# EAGLE board Shutdown_2019_v1.1 (EAGLE 9.2.2)
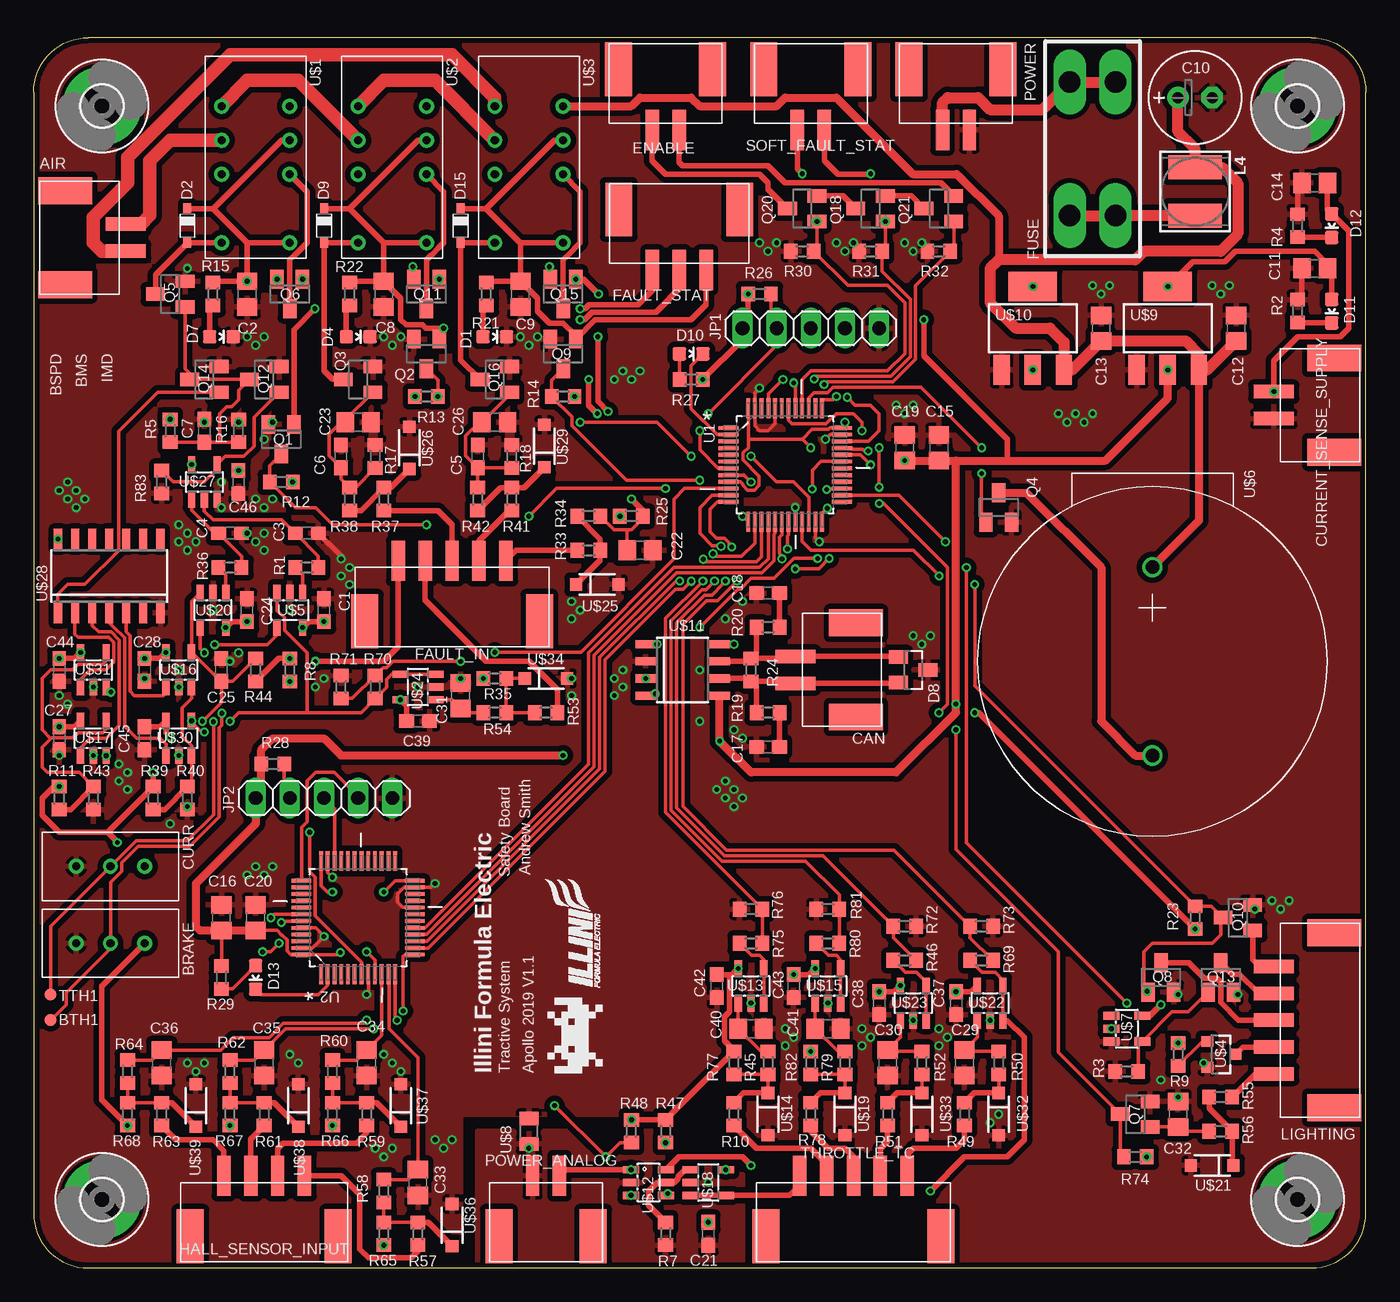
[diagram p10: board, top side]
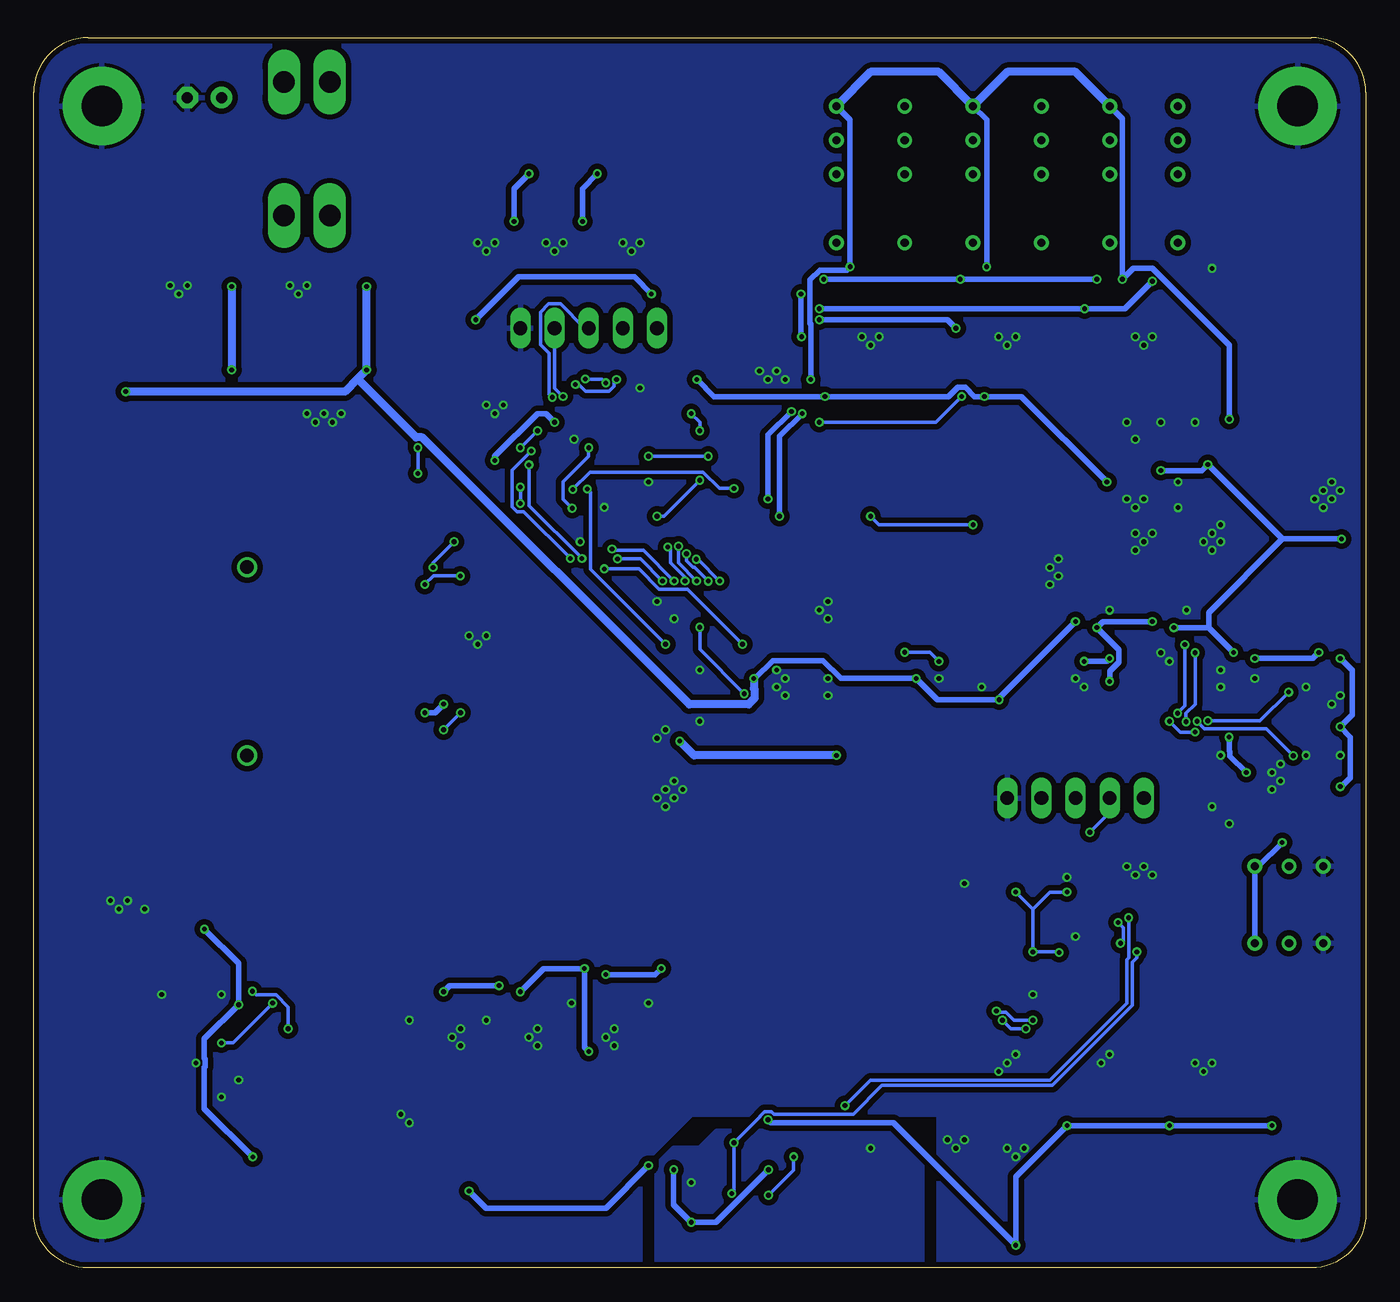
[diagram p11: board, bottom side, seen from below]

Size 99.06 x 91.44 mm. Coordinates in mm from the lower left corner, seen from the top.
Outline: 4.06,0 95,0 arc90 99.06,4.06 99.06,87.38 arc90 95,91.44 4.06,91.44 arc90 0,87.38 0,4.06 arc90 4.06,0
Copper layers (1*16): Top 0.035mm / dielectric 1.5mm / Bottom 0.035mm
Design rules "SeeedStudio_2layer_DRU_no_angle_20140221": minimum track width 6mil, minimum drill 12mil, track to track 6mil, track to pad 6mil, pad to pad 6mil, via to via 6mil, smd to smd 0mil, copper to edge 10mil, drill to drill 10mil, minimum pad ring 10mil, minimum via ring 6mil, stop-mask expansion 2mil, vias tented up to drill 100mil, thermal gap 10mil
Net classes: 0 default: width 0.254 mm; 1 PWR: width 0.254 mm; 2 AIR: width 1.27 mm; 3 PWR_IN: width 0.406 mm

## Footprints (pad centres in the part's own frame; a part is rotated, then mirrored left to right if it is on the bottom)
505575-02 = smd 1 x 3: 1 -1,-0.5; 2 1,-0.5 | smd 2 x 4: P$3 -3.5,4; P$4 3.5,4
PV36 = drill 0.6: A -2.54,0; B 2.54,0; W 0,0
TP09R = smd 0.9 x 0.9: TP 0,0
C0603 = smd 1.1 x 1: 1 -0.85,0; 2 0.85,0
C0805 = smd 1.3 x 1.5: 1 -0.95,0; 2 0.95,0
E2,5-7 = drill 0.813 pad 1.6: + -1.27,0 | drill 0.813 pad 1.6 octagon: - 1.27,0
LED-0603 = smd 1 x 1: A 0,-0.877; C 0,0.877
SOD323-F = smd 0.8 x 0.6: A 1.25,0; C -1.25,0
SOT23 = smd 1 x 1.4: 1 -0.95,-1.1; 2 0.95,-1.1; 3 0,1.1
505575-05 = smd 1 x 3: 1 -4,-0.5; 2 -2,-0.5; 3 0,-0.5; 4 2,-0.5; 5 4,-0.5 | smd 2 x 4: P$3 -6.5,4; P$4 6.5,4
505575-03 = smd 1 x 3: 1 -2,-0.5; 2 0,-0.5; 3 2,-0.5 | smd 2 x 4: P$3 -4.5,4; P$4 4.5,4
3568 = drill 1.6 long: P$1 -4.96,1.7; P$2 4.96,1.7; P$3 4.96,-1.7; P$4 -4.96,-1.7
3,0-PAD = drill 3 pad 5.842: B3,0 0,0
505575-04 = smd 1 x 3: 1 -3,-0.5; 2 -1,-0.5; 3 1,-0.5; 4 3,-0.5 | smd 2 x 4: P$3 -5.5,4; P$4 5.5,4
1X05 = drill 1.016 long: 1 -5.08,0; 2 -2.54,0; 3 0,0; 4 2.54,0; 5 5.08,0
INDUCTOR_5X5MM_NR5040_NOTHERMALS = smd 1.8 x 4: P$1 -1.8,0; P$2 1.8,0
R0603 = smd 1 x 1.1: 1 -0.85,0; 2 0.85,0
QFP50P900X900X160-48N = smd 1.473 x 0.279: 1 -4.216,2.743; 2 -4.216,2.261; 3 -4.216,1.753; 4 -4.216,1.245; 5 -4.216,0.762; 6 -4.216,0.254; 7 -4.216,-0.254; 8 -4.216,-0.762; 9 -4.216,-1.245; 10 -4.216,-1.753; 11 -4.216,-2.261; 12 -4.216,-2.743; 25 4.216,-2.743; 26 4.216,-2.261; 27 4.216,-1.753; 28 4.216,-1.245; 29 4.216,-0.762; 30 4.216,-0.254; 31 4.216,0.254; 32 4.216,0.762; 33 4.216,1.245; 34 4.216,1.753; 35 4.216,2.261; 36 4.216,2.743 | smd 0.279 x 1.473: 13 -2.743,-4.216; 14 -2.261,-4.216; 15 -1.753,-4.216; 16 -1.245,-4.216; 17 -0.762,-4.216; 18 -0.254,-4.216; 19 0.254,-4.216; 20 0.762,-4.216; 21 1.245,-4.216; 22 1.753,-4.216; 23 2.261,-4.216; 24 2.743,-4.216; 37 2.743,4.216; 38 2.261,4.216; 39 1.753,4.216; 40 1.245,4.216; 41 0.762,4.216; 42 0.254,4.216; 43 -0.254,4.216; 44 -0.762,4.216; 45 -1.245,4.216; 46 -1.753,4.216; 47 -2.261,4.216; 48 -2.743,4.216
DPDT_2.54 = drill 0.6: $P1 -6.35,-2.54; $P3 -1.27,-2.54; $P4 1.27,-2.54; $P5 3.81,-2.54; $P8 3.81,2.54; $P9 1.27,2.54; $P10 -1.27,2.54; $P12 -6.35,2.54
SOT23-3 = smd 0.8 x 0.9: 1 -0.95,-1; 2 0.95,-1; 3 0,1.1
SOT23-5 = smd 0.55 x 1.2: 1 -0.95,-1.3; 2 0,-1.3; 3 0.95,-1.3; 4 0.95,1.3; 5 -0.95,1.3
MAS806Q = drill 1: NEG 0,7; POS 0,-7
SOT23-5L = smd 0.6 x 1.2: 1 -0.95,-1.15; 2 0,-1.15; 3 0.95,-1.15; 4 0.95,1.15; 5 -0.95,1.15
L0805 = smd 1.02 x 1.4: 1 -0.94,0; 2 0.94,0
SOT223 = smd 1.219 x 2.235: 1 -2.311,-3.099; 2 0,-3.099; 3 2.311,-3.099 | smd 3.6 x 2.2: 4 0,3.099
SOIC8 = smd 0.6 x 1.5: 1 -1.905,-2.75; 2 -0.635,-2.75; 3 0.635,-2.75; 4 1.905,-2.75; 5 1.905,2.75; 6 0.635,2.75; 7 -0.635,2.75; 8 -1.905,2.75
SOT23-6 = smd 0.55 x 1.2: 1 -0.95,-1.3; 2 0,-1.3; 3 0.95,-1.3; 4 0.95,1.3; 5 0,1.3; 6 -0.95,1.3
SOD-123 = smd 0.9 x 0.95: A 1.575,0; C -1.575,0
SOIC8' = smd 0.6 x 1.5: P1 -3.905,-2.75; P2 -2.635,-2.75; P3 -1.365,-2.75; P4 -0.095,-2.75; P5 1.175,-2.75; P6 2.445,-2.75; P7 3.715,-2.75; P8 3.715,2.75; P9 2.445,2.75; P10 1.175,2.75; P11 -0.095,2.75; P12 -1.365,2.75; P13 -2.635,2.75; P14 -3.905,2.75

## Placement (x,y rotation side)
AIR  505575-02  [505575-02]  6.35,76.58 90 top
BRAKE  PV36  [PV36]  5.71,24.13 180 top
BTH1  TPTP09R  [TP09R]  1.27,18.41 270 top
C1  0.1u  [C0603]  21.59,48.9 90 top
C2  10uF  [C0805]  15.88,72.39 270 top
C3  3u  [C0603]  20.32,54.61 0 top
C4  3u  [C0603]  14.61,54.61 0 top
C5  0.1u  [C0603]  33.02,60.33 90 top
C6  0.1u  [C0603]  22.86,60.33 90 top
C7  0.1u  [C0603]  12.7,62.23 90 top
C8  10uF  [C0805]  26.04,72.39 270 top
C9  10uF  [C0805]  36.2,72.39 270 top
C10  220u  [E2,5-7]  86.36,87 0 top
C11  2.2u  [C0805]  95.25,74.3 180 top
C12  4.7u  [C0805]  89.41,69.85 90 top
C13  4.7u  [C0805]  79.38,69.85 90 top
C14  2.2u  [C0805]  95.25,80.64 180 top
C15  1u  [C0805]  67.31,60.96 90 top
C16  1u  [C0805]  13.97,26.04 90 top
C17  560p  [C0603]  54.61,38.73 180 top
C18  560p  [C0603]  54.61,50.16 180 top
C19  1u  [C0805]  64.77,60.96 90 top
C20  1u  [C0805]  16.51,26.04 90 top
C21  1u  [C0603]  50.16,2.54 270 top
C22  0.1u  [C0805]  45.09,53.34 0 top
C23  0.1u  [C0805]  24.13,62.87 0 top
C24  0.1u  [C0603]  15.88,48.9 90 top
C25  0.01u  [C0603]  13.97,44.45 90 top
C26  0.1u  [C0805]  34.29,62.87 0 top
C27  0.1u  [C0603]  1.91,39.37 270 top
C28  0.1u  [C0603]  8.26,44.45 270 top
C29  0.1u  [C0805]  69.22,15.24 270 top
C30  0.1u  [C0805]  63.5,15.24 270 top
C31  0.001u  [C0805]  31.75,42.55 90 top
C32  0.1u  [C0805]  85.09,11.43 90 top
C33  0.001u  [C0805]  28.57,6.35 270 top
C34  0.001u  [C0805]  24.77,15.24 270 top
C35  0.001u  [C0805]  17.14,15.24 270 top
C36  0.001u  [C0805]  9.53,15.24 270 top
C37  0.1u  [C0603]  68.58,19.68 270 top
C38  0.1u  [C0603]  62.87,19.68 270 top
C39  0.1u  [C0603]  28.57,40.64 0 top
C40  0.001u  [C0805]  53.34,17.78 0 top
C41  0.001u  [C0805]  59.05,17.78 0 top
C42  0.1u  [C0603]  50.8,20.95 270 top
C43  0.1u  [C0603]  56.52,20.95 270 top
C44  0.1u  [C0603]  1.91,44.45 270 top
C45  0.1u  [C0603]  8.26,39.37 270 top
C46  0.1u  [C0603]  15.24,58.42 270 top
CAN  505575-02  [505575-02]  57.15,44.45 270 top
CURR  PV36  [PV36]  5.71,29.84 180 top
CURRENT_SENSE_SUPPLY  505575-02  [505575-02]  92.71,64.14 270 top
D1  BLUE  [LED-0603]  34.29,69.22 270 top
D2  1N914  [SOD323-F]  11.43,77.47 270 top
D4  BLUE  [LED-0603]  24.13,69.22 270 top
D7  BLUE  [LED-0603]  13.97,69.22 270 top
D8  PESD1  [SOT23]  65.41,44.45 270 top
D9  1N914  [SOD323-F]  21.59,77.47 270 top
D10  RED  [LED-0603]  48.9,67.94 270 top
D11  GREEN  [LED-0603]  96.52,71.12 180 top
D12  GREEN  [LED-0603]  96.52,77.47 180 top
D13  RED  [LED-0603]  16.51,21.59 180 top
D15  1N914  [SOD323-F]  31.75,77.47 270 top
ENABLE  505575-02  [505575-02]  46.99,85.09 0 top
FAULT_IN  505575-05  [505575-05]  31.11,52.07 180 top
FAULT_STAT  505575-03  [505575-03]  48.01,74.68 0 top
FUSE  MINI297-3568  [3568]  78.74,83.19 270 top
H1  MOUNT-PAD-ROUND3.0  [3,0-PAD]  93.98,86.36 0 top
H2  MOUNT-PAD-ROUND3.0  [3,0-PAD]  93.98,5.08 0 top
H3  MOUNT-PAD-ROUND3.0  [3,0-PAD]  5.08,5.08 0 top
H4  MOUNT-PAD-ROUND3.0  [3,0-PAD]  5.08,86.36 0 top
HALL_SENSOR_INPUT  505575-04  [505575-04]  17.14,6.35 180 top
JP1  [1X05]  57.78,69.85 0 top
JP2  [1X05]  21.59,34.92 0 top
L4  10u  [INDUCTOR_5X5MM_NR5040_NOTHERMALS]  86.36,80.01 90 top
LIGHTING  505575-05  [505575-05]  92.71,18.41 270 top
POWER  505575-02  [505575-02]  68.58,85.09 0 top
POWER_ANALOG  505575-02  [505575-02]  38.1,6.35 180 top
Q1  DMN6140L-7  [SOT23]  18.41,61.59 180 top
Q2  DMN6140L-7  [SOT23]  29.21,67.94 180 top
Q3  DMN6140L-7  [SOT23]  24.13,66.04 90 top
Q4  DMN6140L-7  [SOT23]  71.75,56.52 0 top
Q5  DMN6140L-7  [SOT23]  10.16,72.39 90 top
Q6  DMP3099L-7  [SOT23]  19.05,72.39 180 top
Q7  DMN6140L-7  [SOT23]  81.92,11.43 90 top
Q8  DMN6140L-7  [SOT23]  83.82,21.59 0 top
Q9  DMN6140L-7  [SOT23]  39.37,67.94 180 top
Q10  DMN6140L-7  [SOT23]  89.53,26.04 90 top
Q11  DMP3099L-7  [SOT23]  29.21,72.39 180 top
Q12  IRLML6346PBF  [SOT23]  17.14,66.04 90 top
Q13  DMN6140L-7  [SOT23]  88.27,21.59 0 top
Q14  IRLML6346PBF  [SOT23]  12.7,66.04 90 top
Q15  DMP3099L-7  [SOT23]  39.37,72.39 180 top
Q16  DMN6140L-7  [SOT23]  34.29,66.04 90 top
Q18  DMN6140L-7  [SOT23]  62.23,78.74 90 top
Q20  DMN6140L-7  [SOT23]  57.15,78.74 90 top
Q21  DMN6140L-7  [SOT23]  67.31,78.74 90 top
R1  100k  [R0603]  20.32,52.07 180 top
R2  100  [R0603]  93.98,71.12 270 top
R3  10k  [R0603]  81.28,14.61 0 top
R4  100  [R0603]  93.98,77.47 270 top
R5  10k  [R0603]  10.16,62.23 90 top
R7  50k  [R0603]  46.99,2.54 90 top
R8  10k  [R0603]  19.05,44.45 270 top
R9  1k  [R0603]  85.09,15.88 270 top
R10  10  [R0603]  52.07,11.43 90 top
R11  1k  [R0603]  1.91,34.92 90 top
R12  10k  [R0603]  18.41,58.42 0 top
R13  10k  [R0603]  29.21,64.77 180 top
R14  10k  [R0603]  39.37,64.77 0 top
R15  900  [R0603]  13.34,72.39 270 top
R16  10k  [R0603]  15.24,62.23 270 top
R17  10k  [R0603]  25.4,60.33 270 top
R18  10k  [R0603]  35.56,60.33 270 top
R19  100  [R0603]  54.61,41.27 180 top
R20  100  [R0603]  54.61,47.62 180 top
R21  900  [R0603]  33.66,72.39 270 top
R22  900  [R0603]  23.5,72.39 270 top
R23  10k  [R0603]  86.36,26.04 270 top
R24  120  [R0603]  53.34,44.45 90 top
R25  1k  [R0603]  44.45,55.88 180 top
R26  10k  [R0603]  53.98,72.39 0 top
R27  10k  [R0603]  48.9,66.04 180 top
R28  10k  [R0603]  17.78,37.47 0 top
R29  10k  [R0603]  13.97,21.59 270 top
R30  10k  [R0603]  57.15,75.56 0 top
R31  10k  [R0603]  62.23,75.56 0 top
R32  10k  [R0603]  67.31,75.56 0 top
R33  100  [R0603]  41.27,53.34 0 top
R34  100k  [R0603]  41.27,55.88 0 top
R35  1k  [R0603]  34.29,43.81 180 top
R36  100k  [R0603]  14.61,52.07 180 top
R37  100  [R0603]  26.04,57.15 90 top
R38  100k  [R0603]  23.5,57.15 90 top
R39  10k  [R0603]  8.89,34.92 90 top
R40  1k  [R0603]  11.43,34.92 90 top
R41  100  [R0603]  35.56,57.15 90 top
R42  100k  [R0603]  33.02,57.15 90 top
R43  10k  [R0603]  4.45,34.92 90 top
R44  1k  [R0603]  16.51,44.45 270 top
R45  10k  [R0603]  54.61,15.24 90 top
R46  10k  [R0603]  64.77,22.86 180 top
R47  10k  [R0603]  46.99,10.16 270 top
R48  10k  [R0603]  44.45,10.16 270 top
R49  10  [R0603]  69.22,11.43 90 top
R50  100k  [R0603]  71.75,15.24 90 top
R51  10  [R0603]  63.5,11.43 90 top
R52  100k  [R0603]  66.04,15.24 90 top
R53  10  [R0603]  38.1,41.27 180 top
R54  10k  [R0603]  34.29,41.27 180 top
R55  100  [R0603]  88.27,12.7 180 top
R56  100k  [R0603]  88.27,10.16 180 top
R57  10  [R0603]  28.57,2.54 90 top
R58  10k  [R0603]  26.04,5.71 90 top
R59  10  [R0603]  24.77,11.43 90 top
R60  10k  [R0603]  22.23,14.61 90 top
R61  10  [R0603]  17.14,11.43 90 top
R62  10k  [R0603]  14.61,14.61 90 top
R63  10  [R0603]  9.53,11.43 90 top
R64  10k  [R0603]  6.99,14.61 90 top
R65  1k  [R0603]  26.04,2.54 270 top
R66  1k  [R0603]  22.23,11.43 270 top
R67  1k  [R0603]  14.61,11.43 270 top
R68  1k  [R0603]  6.99,11.43 270 top
R69  10k  [R0603]  70.48,22.86 180 top
R70  10k  [R0603]  25.4,43.18 270 top
R71  15k  [R0603]  22.86,43.18 270 top
R72  15k  [R0603]  64.77,25.4 180 top
R73  15k  [R0603]  70.48,25.4 180 top
R74  10k  [R0603]  81.92,8.26 0 top
R75  10k  [R0603]  53.34,24.13 180 top
R76  15k  [R0603]  53.34,26.67 0 top
R77  1k  [R0603]  52.07,15.24 90 top
R78  10  [R0603]  57.78,11.43 90 top
R79  10k  [R0603]  60.33,15.24 90 top
R80  10k  [R0603]  59.05,24.13 180 top
R81  15k  [R0603]  59.05,26.67 0 top
R82  1k  [R0603]  57.78,15.24 90 top
R83  10k  [R0603]  9.53,58.42 90 top
SOFT_FAULT_STAT  505575-02  [505575-02]  57.78,85.09 0 top
THROTTLE_TC  505575-05  [505575-05]  60.96,6.35 180 top
TTH1  TPTP09R  [TP09R]  1.27,20.32 270 top
U1  STM32F103CBT6  [QFP50P900X900X160-48N]  55.88,59.69 0 top
U2  STM32F103CBT6  [QFP50P900X900X160-48N]  24.13,26.04 90 top
U$1  EC2  [DPDT_2.54]  16.51,82.55 90 top
U$2  EC2  [DPDT_2.54]  26.67,82.55 90 top
U$3  EC2  [DPDT_2.54]  36.83,82.55 90 top
U$4  DNBT8105  [SOT23-3]  88.27,15.88 270 top
U$5  TS881  [SOT23-5]  19.05,48.9 180 top
U$6  MAS806Q  [MAS806Q]  83.19,45.09 180 top
U$7  SN74LVC1G04DBVR  [SOT23-5L]  81.28,17.78 270 top
U$8  0805_INDUCTOR  [L0805]  36.83,10.16 90 top
U$9  SPX1117M3-L-3-3  [SOT223]  84.33,69.85 0 top
U$10  SPX1117M3-L-5-0  [SOT223]  74.3,69.85 0 top
U$11  MCP2562  [SOIC8]  48.26,44.45 270 top
U$12  MCP4018  [SOT23-6]  45.72,6.35 270 top
U$13  LMV321L  [SOT23-5]  53.34,20.95 0 top
U$14  BZT52C5V6  [SOD-123]  54.61,11.43 270 top
U$15  LMV321L  [SOT23-5]  59.05,20.95 0 top
U$16  TS881  [SOT23-5]  10.79,44.45 0 top
U$17  TS881  [SOT23-5]  4.45,39.37 0 top
U$18  LMV321L  [SOT23-5]  50.16,6.35 270 top
U$19  BZT52C5V6  [SOD-123]  60.33,11.43 270 top
U$20  TS881  [SOT23-5]  13.34,48.9 180 top
U$21  BZT52C13  [SOD-123]  87.63,7.62 180 top
U$22  LMV321L  [SOT23-5]  71.12,19.68 0 top
U$23  LMV321L  [SOT23-5]  65.41,19.68 0 top
U$24  LMV321L  [SOT23-5]  28.57,43.18 90 top
U$25  BZT52C13  [SOD-123]  41.91,50.8 0 top
U$26  BZT52C13  [SOD-123]  27.94,60.96 90 top
U$27  SN74LVC1G08  [SOT23-5]  12.7,58.42 0 top
U$28  CD4072BM96  [SOIC8']  5.71,51.44 0 top
U$29  BZT52C13  [SOD-123]  37.97,61.09 90 top
U$30  TS881  [SOT23-5]  10.79,39.37 0 top
U$31  TS881  [SOT23-5]  4.45,44.45 0 top
U$32  BZT52C5V6  [SOD-123]  71.75,11.43 270 top
U$33  BZT52C5V6  [SOD-123]  66.04,11.43 270 top
U$34  BZT52C5V6  [SOD-123]  38.1,43.81 0 top
U$36  BZT52C5V6  [SOD-123]  31.11,3.17 90 top
U$37  BZT52C5V6  [SOD-123]  27.3,12.06 90 top
U$38  BZT52C5V6  [SOD-123]  19.68,12.06 90 top
U$39  BZT52C5V6  [SOD-123]  12.06,12.06 90 top

## Tracks (layer width: path | path; a pad name or v marks a point on that pad's centre or on a via)
!RST  (via drill 0.35)
  Top 0.254: R26.2 54.83,70.27 JP1.2 55.24,68.58 v50.16,63.5 | v49.53,62.23 49.53,60.81 50.9,59.44 U1.7
  Bottom 0.254: v49.53,62.23 49.53,62.87 v50.16,63.5
!RST_TC  (via drill 0.35)
  Top 0.254: R28.2 18.63,35.34 JP2.2 | v20.52,32.38 20.52,29.44 20.93,29.03 20.93,26.19 24.38,22.73 U2.7
  Bottom 0.254: JP2.2 19.05,33.85 v20.52,32.38
+3V3  (via drill 0.35)
  Top 0.254: R29.1 C16.1 | v22.81,23.45 22.66,23.29 U2.48 19.12,23.29 18.85,23.56 18.85,24.38 18.5,24.74 18.44,24.74 18.09,25.09 C20.1 | v24.77,23.5 25.4,22.86 25.38,22.84 U2.9 | U2.24 26.87,28.78 v26.04,27.94 | U2.36 21.39,28.4 21.84,27.94 v22.23,27.94 | U1.9 52.55,58.45 52.73,58.27 52.73,58.17 53.09,57.81 53.59,57.81 53.95,58.17 53.95,58.86 52.73,60.07 52.73,60.58 53.14,60.98 53.14,61.59 | 53.14,61.59 U1.48 | U1.24 58.62,56.08 v59.01,56.47 | v57.78,60.96 57.15,61.59 | 57.15,61.59 53.14,61.59 | v60.33,62.87 60.33,62.66 U1.36 59.2,62.43 59.1,62.33 57.89,62.33 57.15,61.59
  Top 0.406: D11.A 96.52,73.97 C11.1 96.2,74.61 95.25,75.56 89.34,75.56 88.58,74.8 86.18,74.8 U$9.4 | v49.74,66.04 52.7,69 JP1.1 53.12,70.27 R26.1 | R23.2 70.27,41.27 v69.97,41.27 | v83.82,19.56 82.99,18.73 U$7.5 | v66.19,70.48 66.19,67.8 72.39,61.59 72.39,60.01
  Top 0.61: C19.1 C15.1 68.58,60.01 | 68.58,60.01 72.39,60.01 79.69,60.01 84.33,64.64 U$9.2 | C20.1 C16.1 12.38,25.09 12.06,25.4 12.06,28.57 16.51,33.02 JP2.1 16.93,35.34 R28.1 16.93,38.52 17.78,39.37 21.59,39.37 22.86,38.1 v39.37,38.1 | 68.58,60.01 v68.58,41.91 68.58,41.27 64.14,36.83 53.34,36.83 v51.01,39.16 U$11.5
  Bottom 0.254: v22.81,23.45 22.86,23.5 v24.77,23.5 24.77,26.67 | v26.04,27.94 24.77,26.67 | v22.23,27.94 23.5,27.94 24.77,26.67 | v59.01,56.47 59.69,57.15 59.69,58.42 57.78,60.33 v57.78,60.96
  Bottom 0.406: R12.2 25.61,64.77 R13.2 29.09,64.77 29.78,65.45 30.34,65.45 31.03,64.77 R14.2 48.48,64.77 v49.74,66.04 | v69.97,41.27 69.22,41.27 v68.58,41.91 | R23.2 83.82,22.64 v83.82,19.56 86.36,17.02 86.36,15.57 86.31,15.52 86.31,14.96 86.36,14.91 86.36,11.85 R74.2 | v60.33,62.87 60.96,63.5 61.59,63.5 64.77,60.33 C19.1 | R26.1 54.4,73.66 63.02,73.66 v66.19,70.48
  Bottom 0.61: U$9.4 U$9.2 | v39.37,38.1 49.95,38.1 v51.01,39.16
  other vias: 19.27,58.42 28.36,64.77 40.22,64.77 84.33,72.95 84.33,66.75 86.36,25.18 82.77,8.26 64.77,60.01 53.12,72.39
+5V  (via drill 0.35)
  Top 0.406: C43.1 57.66,21.8 U$15.5 | C42.1 51.94,21.8 | 51.94,21.8 U$13.5 | C38.1 64,20.54 U$23.5 | C37.1 69.72,20.54 U$22.5 | U$24.5 27.73,41.78 C39.1 | v14.29,47.59 14.73,48.05 C24.1 | v20,47.59 20.45,48.05 C1.1 | C44.1 3.04,45.3 U$31.5 | C28.1 9.39,45.3 U$16.5 | C27.1 3.04,40.22 U$17.5 | C45.1 9.39,40.22 U$30.5 9.85,39.78 v10.17,39.46 | C14.1 96.2,78.67 D12.A 97.79,77.08 97.79,69.85 97.16,69.22 93.98,69.22 92.21,67.44 CURRENT_SENSE_SUPPLY.1 | 5.5,32.38 R39.2 v8.89,36.83 | R11.2 1.49,35.77 0.64,34.92 0.64,33.66 1.91,32.38 5.5,32.38 | 5.5,32.38 6.22,31.66 v6.22,31.62 | R68.2 5.08,12.48 5.08,20.95 BRAKE.A | R48.1 R47.1 R77.2 52.07,16.2 51.38,16.88 51.38,18.68 51.76,19.05 51.76,21.62 51.94,21.8
  Bottom 0.406: v14.29,47.59 11.69,47.59 | 11.69,47.59 U$16.5 | C28.1 3.94,45.3 U$31.5 | C44.1 1.02,44.41 1.02,41.11 C27.1 1.14,39.46 1.14,36.45 1.82,35.77 R11.2 | v6.22,31.62 8,29.84 CURR.A BRAKE.A | R68.2 R67.2 R66.2 26.04,6.77 R65.2 35.14,10.79 44.23,10.79 R48.1 | U$13.5 52.84,21.8 C43.1 | C38.1 61.15,22.25 U$15.5 58.1,16.41 R82.2 | U$23.5 68.13,20.98 C37.1 | C24.1 19.55,48.05 v20,47.59 18.37,45.96 18.37,45.02 19.05,44.33 R8.2 | C1.1 27.27,42.36 U$24.5 31.86,42.23 R35.2 39.04,43.81 40.36,45.13 44.1,45.13 45.42,43.81 v45.51,43.81 | C46.1 12.2,59.27 U$27.5 6.21,54.19 | U$28.P14 6.21,54.19 | 6.21,54.19 11.69,48.71 11.69,47.59 | v8.89,36.83 10.11,38.05 10.11,38.38 10.17,38.44 v10.17,39.46
  Bottom 0.61: U$10.4 U$10.2 74.97,66.08 | 74.97,66.08 75.91,65.14 CURRENT_SENSE_SUPPLY.1 | 74.97,66.08 70.64,61.74 70.16,61.74 50.3,41.89 45.9,41.89 45.44,42.35 45.44,43 45.51,43.06 v45.51,43.81
  other vias: 9.85,45.75 8.26,45.3 3.5,45.75 1.91,45.3 1.91,40.22 1.91,35.77 6.99,10.58 14.61,10.58 22.23,10.58 26.04,1.69 44.45,11.01 52.39,22.25 56.52,21.8 58.1,22.25 62.87,20.54 64.45,20.98 68.58,20.54 74.3,66.75 74.3,72.95 92.21,65.14 27.27,42.23 15.88,48.05 21.59,48.05 33.44,43.81 19.05,43.6 11.75,59.72 15.24,59.27 1.81,54.19 57.78,16.09
+12V  (via drill 0.35)
  Top 0.406: Q11.2 28.26,74.36 v28.19,74.42 | Q15.2 38.42,74.36 v38.35,74.42 | v41.27,66.04 41.27,64.14 v41.91,63.5
  Top 0.61: U$9.3 86.64,55.54 U$6.POS | U$3.$P5 44.45,86.36 45.09,87 48.9,87 49.53,86.36 55.24,86.36 55.88,87 59.69,87 65.38,81.31 68.64,81.31 71.75,78.19 71.75,74.93
  Top 0.813: C10.+ 85.09,84.45 86.36,83.19 L4.P$2 88.37,81.81 89.53,80.64 89.53,76.83 88.27,75.56 82.55,75.56 81.92,74.93 71.75,74.93 71.12,74.3 71.12,71.75 73.03,69.85 75.56,69.85 76.61,68.81 U$10.3 77.23,66.75 C13.1 85.66,68.9 86.64,67.92 U$9.3 87.26,66.75 C12.1
  Bottom 0.406: U$1.$P5 18.1,85.41 Q6.2 17.3,74.3 15.86,74.3 10.16,68.59 R5.2 | v28.19,74.42 28.19,85.34 U$2.$P5 | U$3.$P5 38.35,85.34 v38.35,74.42 38.6,74.17 40.6,74.17 41.32,73.45 41.32,70.2 41.27,70.15 v41.27,66.04 | v41.91,63.5 43.6,61.81 R25.2
  Bottom 0.61: U$1.$P5 21.59,88.9 26.67,88.9 U$2.$P5 31.75,88.9 36.83,88.9 U$3.$P5
  other vias: 18.1,73.49 10.16,63.08 43.6,55.88
AGND  (via drill 0.35)
  other vias: 36.83,8.89 50.16,6.35
  pour Top (isolate 0.406): 33.02,0 52.7,0 52.7,7.62 51.44,8.89 50.8,9.53 49.53,9.53 48.9,10.16 40.01,10.16 33.02,10.16
  pour Bottom (isolate 0.406): 35.56,10.16 33.02,7.62 33.02,0 52.7,0 52.7,7.62 51.44,8.89 49.53,8.89 48.26,10.16
AIR_IN
  Top 1.016: AIR.2 7.99,77.58 8.64,78.23 8.64,82.3 10.16,83.82 U$1.$P9
AIR_OUT
  Top 1.016: AIR.1 5.06,75.58 4.45,76.2 4.45,78.11 5.08,78.74 6.99,80.64 6.99,82.55 14.61,90.17 31.11,90.17 34.29,87 U$3.$P8
ANALOG_5V  (via drill 0.35)
  Top 0.406: POWER_ANALOG.1 39.55,7.3 U$12.1
  Bottom 0.406: v51.47,7.3 51.47,4.69 C21.1 48.33,3.39 U$12.1
  other vias: 50.16,3.39 44.42,7.3
APPS_EN  (via drill 0.35)
  Top 0.254: Q20.1 58.25,75.81 R30.2 60.54,73.03 63.5,73.03 64.77,71.75 64.77,67.94 63.5,66.67 57.78,66.67 57.12,66.02 U1.40
  Top 0.406: SOFT_FAULT_STAT.1 56.78,81.69 v57.15,81.33
  Bottom 0.406: v57.15,81.33 58.25,80.23 Q20.1
  other vias: 58.25,77.79
BRAKE_LIGHT-
  Top 0.406: U$4.3 89.91,16.41 LIGHTING.4
BRAKE_LIGHT_EN  (via drill 0.35)
  Top 0.254: U1.26 64.34,57.43 v67.8,53.98 | v69.36,52.07 69.36,31.6 v81.28,19.68
  Bottom 0.254: v67.8,53.98 69.36,52.41 v69.36,52.07 | v81.28,19.68 84.24,16.73 R9.1
  other vias: 85.09,16.73
BRAKE_POS
  Top 0.406: R10.1 53.76,8.89 57.78,8.89 59.05,7.62 59.05,6.95 THROTTLE_TC.4
BRAKE_POS_F
  Top 0.254: R75.2 53.38,23.24 53.98,23.24 54.29,22.93 U$13.4 U$13.3
BRAKE_POS_F_3_3  (via drill 0.35)
  Top 0.254: R75.1 R76.2 46.99,33.87 46.99,48.29 v49.76,51.06 | v51.1,53.64 50.82,53.64 50.77,53.69 50.45,53.69 49.53,54.61 49.53,56.52 50.44,57.43 U1.11
  Bottom 0.254: v51.1,53.64 51.1,53.36 51.13,53.34 51.13,52.42 v49.76,51.06
BRAKE_PRESSURE
  Top 0.406: FAULT_IN.4 29.11,49.62 33.66,45.09 36.83,45.09 38.95,42.97 R53.1
BRAKE_PRESSURE_F  (via drill 0.35)
  Top 0.254: U$24.3 U$24.4 26.6,44.13 26.23,43.76 26.23,43.16 R70.2 24.34,41.27 20.32,41.27 | U$31.3 v5.74,42.8 | v14.61,40.64 15.24,41.27 20.32,41.27 | U$30.4 11.95,40.47 11.95,40.39 12.5,39.83 v12.7,39.83 | U$5.3 18.1,48.87 18.65,48.31 18.65,47.39 20.32,45.72 20.32,41.27
  Bottom 0.254: v5.74,42.8 7.87,40.67 U$30.4 | v14.61,40.64 13.8,39.83 v12.7,39.83
  other vias: 11.74,40.67
BRAKE_PRESSURE_F_3_3  (via drill 0.35)
  Top 0.254: R71.2 23.7,42.33 R70.1 25.97,44.6 26.23,44.6 26.72,45.09 v31.75,45.09 | v34.29,45.77 40.69,45.77 47.62,52.7 47.62,57.15 48.41,57.94 U1.10
  Bottom 0.254: v34.29,45.77 32.43,45.77 v31.75,45.09
BRAKE_TH  (via drill 0.35)
  Top 0.254: BTH1.TP 2.41,19.56 2.41,20.45 5.71,23.75 BRAKE.W 5.71,28.67 6.55,29.5 6.55,30.1 7.79,31.34 11.6,31.34 13.78,33.52 13.78,40.15 13.98,40.35 13.98,41.21 v14.01,41.24 | v13.46,46.33 17.37,46.33 18.1,47.06 U$5.4
  Bottom 0.254: v14.01,41.24 13.46,41.78 v13.46,46.33
BSPD_BP_OC
  Top 0.254: U$31.1 3.5,43.75 4.21,44.46 5.38,44.46 5.86,44.94 5.94,45.03 5.95,45.03 5.95,46.5 5.59,46.86 3.3,46.86 3.05,47.12 3.05,48.65 U$28.P2
BSPD_BP_SC
  Top 0.254: U$28.P4 5.62,47.97 5.92,47.68 6.76,46.84 6.76,44.7 6.76,44.69 6.76,40.27 7.66,39.37 9.4,39.37 9.85,38.92 U$30.1
BSPD_BRAKE_COND
  Top 0.254: R1.1 21.17,52.91 C3.1 18.45,55.63 13.34,55.63 12.7,56.26 U$27.2
BSPD_COND
  Top 0.254: Q12.1 16.38,63.23 16.38,61.08 15.63,60.33 14.26,60.33 U$27.4 13.65,59.37 12.7,58.42 10.38,58.42 R83.2
BSPD_CS_OC
  Top 0.254: U$17.1 3.5,38.67 4.21,39.38 5.38,39.38 6.35,40.35 6.35,44.86 6.36,44.87 6.36,46.67 5.76,47.27 4.83,47.27 4.35,47.74 U$28.P3
BSPD_CS_SC
  Top 0.254: U$28.P5 6.89,47.28 7.17,47.01 7.17,42.87 7.49,42.55 9.65,42.55 9.85,42.74 U$16.1
BSPD_CURR_COND
  Top 0.254: R36.1 15.46,52.91 C4.1 13.46,54.61 11.75,56.32 U$27.1
BSPD_SENSOR_FAULT
  Top 0.254: Q14.1 9.21,65.09 6.31,62.19 6.31,53.3 3.81,50.8 2.54,50.8 1.81,50.07 U$28.P1
BTSF_EN  (via drill 0.35)
  Top 0.254: Q18.1 63.33,75.81 R31.2 63.08,74.08 65.18,71.98 65.18,67.72 63.73,66.27 58.24,66.27 v58.04,66.07 | v56.52,65.79 56.64,65.66 U1.41
  Top 0.406: SOFT_FAULT_STAT.2 58.78,82.31 59.82,81.28 62.18,81.28 v62.23,81.33
  Bottom 0.254: v58.04,66.07 56.8,66.07 v56.52,65.79
  Bottom 0.406: v62.23,81.33 63.33,80.23 Q18.1
  other vias: 63.33,77.79
CAN_RX  (via drill 0.35)
  Top 0.254: U$11.4 46.1,42.55 v46.23,42.67 | v49.53,47.62 52.35,50.45 52.54,50.45 53.35,51.26 55.06,51.26 56.53,52.73 v58.29,52.73 | v62.23,59.69 61.47,60.45 U1.32
  Bottom 0.254: v46.23,42.67 49.53,45.97 v49.53,47.62 | v58.29,52.73 62.23,56.67 v62.23,59.69
CAN_STBY  (via drill 0.35)
  Top 0.254: U$11.8 v52.07,46.35 | v57.9,57.9 57.9,59.29 58.55,59.94 U1.31
  Bottom 0.254: v52.07,46.35 57.66,51.94 57.66,57.66 v57.9,57.9
CAN_TX  (via drill 0.35)
  Top 0.254: U$11.1 v46.35,46.35 | v56.62,51.96 58.38,51.96 v59.15,52.73 | v62.06,60.72 61.77,60.72 61.62,60.87 60.92,60.87 60.83,60.96 60.12,60.96 U1.33
  Bottom 0.254: v46.35,46.35 50.45,50.45 52.54,50.45 54.06,51.96 v56.62,51.96 | v62.06,60.72 63.47,59.31 63.47,56.57 63.12,56.22 62.63,56.22 v59.15,52.73
CANH
  Top 0.406: U$11.7 53.12,45.09 R24.2 | R24.2 56.5,45.3 CAN.1 64.25,45.45 D8.1 | R20.2 53.76,45.72 R24.2
CANL
  Top 0.406: D8.2 64.25,43.45 CAN.2 56.5,43.6 R24.1 | R24.1 53.12,43.81 U$11.6 | R24.1 53.76,43.18 R19.2
CURR_TH  (via drill 0.35)
  Top 0.254: TTH1.TP 1.27,25.4 CURR.W 7.62,31.75 11.43,31.75 13.37,33.69 v13.37,40.6 | v12.7,45.72 12.38,46.03 U$20.4
  Bottom 0.254: v13.37,40.6 13.37,41.24 12.7,41.91 v12.7,45.72
CURRENT_SENSE  (via drill 0.35)
  Top 0.406: R8.1 18.21,45.3 R44.2 | FAULT_IN.5 27.11,46.16 26.04,45.09 v20.95,45.09
  Bottom 0.406: v20.95,45.09 19.27,45.09 R8.1
  other vias: 19.05,45.3
CURRENT_SENSE_F  (via drill 0.35)
  Top 0.254: R44.1 14.81,43.6 C25.1 | C25.1 13.89,43.6 U$16.4 11.74,49.55 U$20.3 | v12.55,40.64 13.97,42.06 C25.1
  Bottom 0.254: v12.55,40.64 12.35,40.44 12.35,40.42 12,40.06 7.39,40.06 v5.39,38.07
DEBUG
  Top 0.254: D10.C 48.9,67.07 48.9,63.88 50.83,61.95 U1.2
DEBUG_TC
  Top 0.254: D13.C 16.9,20.32 21.16,20.32 21.87,21.03 U2.2
ENABLE_IN
  Top 0.406: ENABLE.2 47.99,82.19 48.26,81.92 54.61,81.92 55.88,80.64 67.45,80.64 Q21.2
ENABLE_OUT
  Top 0.406: Q20.3 54.61,80.18 54.61,80.64 53.98,81.28 46.99,81.28 45.99,82.28 ENABLE.1
FAULT_BMS
  Top 0.406: R37.1 30.06,56.3 31.11,55.24 FAULT_IN.3
FAULT_BMS_F
  Top 0.254: R17.2 23.93,58 R38.2 22.86,58.63 C6.1 21.97,60.36 21.97,61.98 22.86,62.87 C23.1 23.18,63.04 Q3.1
FAULT_BMS_STAT  (via drill 0.35)
  Top 0.406: D9.C 21.61,78.74 23.5,78.74 | 23.5,78.74 28.57,83.82 U$2.$P4 | 23.5,78.74 26.04,76.2 | 26.04,76.2 U$2.$P1 | 26.04,76.2 C8.1 | C8.1 23.59,73.34 R22.1 | Q2.1 30.16,69.53 v30.48,69.85 29.16,69.85 28.91,70.1 27.69,70.1 27.3,70.48 27.3,72.07 26.93,72.45 C8.1 | v40.64,70.48 40.97,70.48 41.53,71.04 46.28,71.04 48.26,73.03 48.01,73.28 FAULT_STAT.2
  Bottom 0.406: v30.48,69.85 31.11,70.48 v40.64,70.48
FAULT_BMS_STATUS_3_3  (via drill 0.35)
  Top 0.254: Q2.3 30.06,66 R13.1 | v40.64,62.87 46.35,62.87 v48.9,60.33 | v53.34,60.33 55.24,58.42 56.52,58.42 57.63,57.3 U1.22
  Bottom 0.254: R13.1 31.86,62.97 31.96,62.87 v40.64,62.87 | v48.9,60.33 v53.34,60.33
  other vias: 30.06,64.77
FAULT_BSPD
  Top 0.254: 13.84,61.38 C7.1 R5.1 | 13.84,61.38 R16.2 | 12.06,66.04 Q12.3 15.24,65.23 15.24,64.52 14.73,64.01 14.35,64.01 13.84,63.5 13.84,61.38 | 12.06,66.04 Q14.3 | Q5.1 11.26,66.84 12.06,66.04
FAULT_BSPD_STAT  (via drill 0.35)
  Top 0.406: D2.C 13.36,78.72 | 13.36,78.72 15.88,76.2 | 15.88,76.2 U$1.$P1 | 13.36,78.72 18.45,83.82 U$1.$P4 | 15.88,76.2 C2.1 13.44,73.34 R15.1 | FAULT_STAT.1 46.01,72.68 44.93,71.6 41.3,71.6 40.99,71.29 v40.64,71.29 | Q1.1 19.36,69.75 v20.91,71.29
  Bottom 0.406: v40.64,71.29 v20.91,71.29 17.92,71.29 C2.1
  other vias: 15.88,73.34
FAULT_BSPD_STATUS_3_3  (via drill 0.35)
  Top 0.254: Q1.3 17.57,59.65 R12.1 19.47,56.52 20.95,56.52 22.23,55.24 v29.21,55.24 | v36.83,55.88 38.89,57.94 v46.99,57.94 | v58.98,57.86 59.02,57.91 60.07,57.91 U1.27
  Bottom 0.254: v29.21,55.24 36.2,55.24 v36.83,55.88 | v46.99,57.94 48.06,57.94 49.28,59.15 57.69,59.15 v58.98,57.86
FAULT_IMD
  Top 0.406: FAULT_IN.2 33.12,54.07 35.34,56.3 R41.1
FAULT_IMD_F
  Top 0.254: R42.2 C5.1 | C5.1 R18.2 | C5.1 32.13,60.36 32.13,61.85 33.15,62.87 C26.1 35.39,64.92 Q16.1
FAULT_IMD_STAT
  Top 0.406: D15.C 33.63,78.72 | U$3.$P4 38.73,83.82 33.63,78.72 | 33.63,78.72 36.16,76.2 | 36.16,76.2 U$3.$P1 | C9.1 36.2,76.16 36.16,76.2 | C9.1 33.76,73.34 R21.1 | C9.1 37.09,72.45 37.47,72.07 37.47,71.12 38.35,70.23 39.37,70.23 40.32,69.28 Q9.1 41.76,70.48 48.9,70.48 50.01,71.6 FAULT_STAT.3
FAULT_IMD_STATUS_3_3  (via drill 0.35)
  Top 0.254: Q9.3 38.52,66 R14.1 40.03,63.26 40.03,62.61 44.1,58.54 v49.53,58.54 | v52.7,55.88 52.73,55.88 U1.13
  Bottom 0.254: v49.53,58.54 52.19,55.88 v52.7,55.88
FAULT_RESET
  Top 0.406: FAULT_IN.1 35.88,53.34 R33.1
FAULT_RESET_F  (via drill 0.35)
  Top 0.254: R34.2 43.14,54.86 44.07,54.86 | 44.07,54.86 44.45,54.86 45.3,55.71 R25.1 | C22.1 44.13,54.8 44.07,54.86
  Top 0.406: Q15.1 40.91,73.49 v42.01,72.39 | v41.96,69.22 41.96,64.42 v42.72,63.66 | v44.45,57.15 45.3,56.3 R25.1
  Bottom 0.406: Q6.1 Q11.1 Q15.1 | v42.01,72.39 42.01,69.26 v41.96,69.22 | v42.72,63.66 44.45,61.93 v44.45,57.15
  other vias: 20,73.49 30.16,73.49 40.32,73.49
GND  (via drill 0.35)
  Top 0.254: U2.47 20.73,23.77 v21.59,24.64 20.95,25.27 U2.44 | U2.8 24.89,20.45 v24.77,20.32 | U2.20 27.43,26.8 27.05,27.18 27.05,27.81 27.53,28.3 U2.23 29.57,28.3 v29.84,28.57 | U2.35 21.87,29.39 v22.23,29.04 | U1.8 52.83,58.93 v53.34,58.42 | U1.44 55.12,62.74 54.61,62.23 53.98,62.23 53.62,62.59 U1.47 53.62,65.05 v53.98,65.41 | U1.35 59.29,61.95 59.27,61.92 59.21,61.92 v58.88,61.59 | U1.20 56.64,56.52 v56.63,56.53 | U1.23 58.14,54.25 v58.42,53.98
  Top 0.406: C14.2 93.98,80.33 R4.1 | R2.1 94.3,72.29 C11.2 | C3.2 22.86,52.92 v22.86,52.7
  other vias: 10.79,55.24 10.79,53.98 11.43,54.61 12.06,53.98 11.43,53.34 16.51,57.15 17.14,56.52 17.78,57.15 13.97,56.52 13.97,58.42 15.88,54.61 16.51,53.98 17.14,54.61 17.14,53.34 13.34,48.9 1.91,57.78 2.54,57.15 3.17,56.52 2.54,58.42 3.17,57.78 3.81,57.15 22.86,51.44 23.5,50.8 23.5,52.07 28.57,43.18 31.75,43.81 40.01,43.81 40.01,42.55 43.81,44.45 43.81,43.18 43.18,43.81 43.18,42.55 50.8,35.56 51.44,34.92 51.44,36.2 52.07,35.56 52.07,34.29 52.7,34.92 21.59,43.81 20.95,43.18 43.18,66.04 43.81,66.67 44.45,66.04 45.09,66.67 36.2,69.22 36.83,68.58 37.47,69.22 26.04,69.22 26.67,68.58 27.3,69.22 15.88,69.22 16.51,68.58 17.14,69.22 15.24,62.87 12.7,62.87 15.88,29.21 16.51,29.84 17.14,29.21 17.78,29.84 11.43,15.24 12.06,14.61 12.7,15.24 19.05,15.88 19.68,15.24 26.04,15.88 26.67,15.24 27.3,14.61 25.4,8.89 26.04,8.26 26.67,8.89 29.84,9.53 30.48,8.89 31.11,9.53 6.35,37.47 6.99,36.83 6.35,36.2 6.99,35.56 1.91,38.1 1.91,42.55 2.54,41.91 4.45,38.1 10.79,38.1 10.79,44.45 10.79,43.18 8.26,43.81 4.45,43.18 55.88,17.78 56.52,17.14 55.88,16.51 61.59,17.78 62.23,17.14 61.59,16.51 67.31,17.78 67.94,17.14 67.31,16.51 71.12,18.41 65.41,18.41 59.05,19.68 53.34,19.68 85.09,12.7 83.82,13.97 87,15.24 89.53,20.32 85.09,20.32 90.81,26.67 92.08,27.3 92.71,26.67 93.34,27.3 11.43,74.3 71.75,11.43 71.12,10.79 10.16,33.02 11.43,34.29 14.61,45.09 15.24,45.72 40.01,49.53 40.64,48.9 40.01,48.26 17.78,62.87 17.14,61.59 52.07,40.01 52.7,39.37 65.41,46.99 66.04,46.35 66.67,46.99 52.7,49.53 51.44,48.26 49.53,44.45 49.53,40.64 78.74,73.03 79.38,72.39 80.01,73.03 87.63,73.03 88.27,72.39 88.9,73.03 76.2,63.5 76.83,62.87 77.47,63.5 78.11,62.87 78.74,63.5 64.14,64.14 64.77,63.5 65.41,64.14 59.69,76.2 60.33,75.56 60.96,76.2 64.77,76.2 65.41,75.56 66.04,76.2 53.98,76.2 54.61,75.56 55.24,76.2 19.05,48.9
  pour Top (isolate 0.406): 0,91.44 0,0 31.75,0 31.75,11.43 32.38,11.43 48.9,11.43 50.16,11.43 53.98,7.62 53.98,0 99.06,0 99.06,91.44
  pour Bottom (isolate 0.406): 0,91.44 0,0 31.75,0 31.75,11.43 50.16,11.43 53.98,7.62 53.98,0 99.06,0 99.06,91.44 66.04,91.44
HALL_FL
  Top 0.406: HALL_SENSOR_INPUT.1 22.87,6.85 24.26,5.46 24.26,1.4 24.89,0.76 28.07,0.76 28.57,1.27 R57.1
HALL_FL_F
  Top 0.254: R58.2 27.84,6.57 C33.1 28.57,15.62 26.42,17.78 26.42,21.79 U2.11
HALL_FR
  Top 0.406: HALL_SENSOR_INPUT.2 18.14,8.87 18.54,9.27 24,9.27 24.77,10.03 R59.1
HALL_FR_F
  Top 0.254: R60.2 24.03,15.46 C34.1 25.88,17.31 U2.10
HALL_RL
  Top 0.406: HALL_SENSOR_INPUT.3 16.14,9.58 R61.1
HALL_RL_F  (via drill 0.35)
  Top 0.254: R62.2 16.41,15.46 C35.1 18.73,17.78 v25.28,17.78 | v27.02,18.41 26.87,18.57 U2.12
  Bottom 0.254: v25.28,17.78 26.39,17.78 v27.02,18.41
HALL_RR
  Top 0.406: R63.1 10.58,9.53 13.34,9.53 14.14,8.71 HALL_SENSOR_INPUT.4
HALL_RR_F  (via drill 0.35)
  Top 0.254: R64.2 8.79,15.46 C36.1 13.89,16.19 14.82,17.12 17.5,17.12 18.57,18.19 24.54,18.19 v24.77,18.41 | v27.48,19.1 27.48,23.16 27.61,23.29 U2.13
  Bottom 0.254: v24.77,18.41 26.16,18.41 26.77,19.02 27.4,19.02 v27.48,19.1
HV_CONNECTED_3_3  (via drill 0.35)
  Top 0.254: v69.97,50.8 69.97,43.27 R23.1 87.58,26.89 Q10.3 88.27,25.86 88.27,24.77 87.63,24.13 83.19,24.13 82.55,23.5 82.55,20.81 v82.8,20.57 Q8.1 | v67.34,51.44 65.43,53.34 57.78,53.34 57.12,54 U1.21
  Bottom 0.254: v69.97,50.8 69.34,51.44 v67.34,51.44 | v82.8,20.57 82.52,20.29 81.03,20.29 80.13,19.39 U$7.2
  other vias: 80.13,17.78
N$1
  Top 0.406: U$2.$P12 24.11,76.22 D9.A 21.59,66.67 22.23,66.04 Q3.3
N$2
  Top 0.406: R55.2 87.42,11.86 R56.1 89.11,7.71 U$21.C
N$3
  Top 0.254: R9.2 86.89,16.82 U$4.1
N$4
  Top 0.61: Q4.3 73.83,57.62 79.38,52.07 79.38,40.64 81.93,38.09 U$6.NEG
N$5
  Top 0.254: U$14.C R45.1 R77.1
  Top 0.406: R10.2 52.8,13.01 U$14.C
N$6
  Top 0.813: L4.P$1 80.45,78.21 FUSE.P$2 FUSE.P$3
N$7
  Top 0.254: R45.2 54.08,16.09 C40.1 U$13.1
N$8
  Top 0.406: R15.2 13.09,71.3 D7.A
N$9
  Top 0.254: R3.2 82.13,16.53 U$7.4 84.65,19.05 85.88,19.05 Q13.1
N$10
  Top 0.406: D12.C 94.01,76.59 R4.2
N$11
  Top 0.406: R2.2 96.49,70.27 D11.C
N$12
  Top 0.406: U$18.1 48.44,7.3 47.91,6.77 47.91,6.63 47.62,6.35 U$12.5 46.35,6.35 45.72,5.71 45.72,4.66 R7.2
N$13
  Top 0.254: R36.2 14.29,51.54 U$20.1
N$14
  Top 0.406: R19.1 C17.1
N$17
  Top 0.406: C18.1 R20.1
N$18
  Top 0.254: R1.2 20,51.54 U$5.1
N$19
  Top 0.254: D10.A 48.02,66.07 R27.2
N$20
  Top 0.254: U$32.C R50.1
  Top 0.406: R49.2 69.94,13.01 U$32.C
N$21
  Top 0.254: R29.2 14.78,20.74 D13.A
N$22
  Top 0.254: U$19.C R79.1 R82.1
  Top 0.406: R78.2 58.51,13.01 U$19.C
N$23
  Top 0.254: R79.2 59.8,16.09 C41.1 U$15.1
N$24
  Top 0.406: Q18.3 60.18,79.69 Q20.2
N$25
  Top 0.406: Q21.3 65.26,79.69 Q18.2
N$27
  Top 1.016: U$1.$P8 15.88,88.27 19.68,88.27 U$2.$P9
N$28
  Top 0.406: Q6.3 19.05,74.93 19.41,75.29 19.43,75.29 19.96,75.82 19.96,75.84 20.32,76.2 20.32,80.01 U$1.$P3
N$29
  Top 0.406: U$25.C 42.12,52.59 R33.2 42.12,54.18 R34.1
N$31
  Top 1.016: U$2.$P8 26.04,88.27 29.84,88.27 U$3.$P9
N$32
  Top 0.406: U$1.$P12 11.45,76.2 | 11.45,76.2 D2.A | Q5.3 9.06,73.81 11.45,76.2
N$34
  Top 0.406: R22.2 23.25,71.3 D4.A
N$35
  Top 0.406: Q11.3 29.21,74.93 29.57,75.29 29.59,75.29 30.12,75.82 30.12,75.84 30.48,76.2 30.48,80.01 U$2.$P3
N$37
  Top 0.406: R38.1 24.34,56.3 R37.2 26.55,58 U$26.C
N$38
  Top 0.254: U$22.1 70.17,17.14 C29.1 69.31,16.09 R50.2
N$42
  Top 0.406: R21.2 33.41,71.3 D1.A
N$43
  Top 0.406: U$3.$P3 40.64,80.01 40.64,76.18 39.75,75.29 39.73,75.29 39.37,74.93 Q15.3
N$44
  Top 0.406: U$3.$P12 34.27,76.22 D15.A 31.75,67.48 Q16.3
N$49
  Top 0.406: R42.1 34.72,58 R41.2 36.46,58 U$29.C
N$52
  Top 0.254: U$33.C R52.1
  Top 0.406: R51.2 64.22,13.01 U$33.C
N$53
  Top 0.254: R52.2 63.6,16.09 C30.1 64.45,17.14 U$23.1
N$59
  Top 0.254: U$34.C R35.1 R54.1 R53.2
N$60
  Top 0.254: R54.2 32.07,41.27 C31.1 31.11,42.23 U$24.1
N$65
  Top 0.254: R58.1 R65.1 R57.2
  Top 0.406: R57.2 29.32,3.39 U$36.C
N$68
  Top 0.254: R59.2 R66.1 R60.1
  Top 0.406: R59.2 25.52,12.28 U$37.C
N$71
  Top 0.254: R61.2 R67.1 R62.1
  Top 0.406: R61.2 17.89,12.28 U$38.C
N$74
  Top 0.254: R63.2 R68.1 R64.1
  Top 0.406: R63.2 10.28,12.28 U$39.C
OC_TH
  Top 0.254: R43.2 3.39,36.83 1.02,36.83 0.64,37.21 0.64,38.7 1.29,39.35 | 1.29,39.35 0.64,40 0.64,43.81 1.29,44.47 2.9,44.47 3.3,44.87 5.12,44.87 5.39,45.15 U$31.4 | 1.29,39.35 1.33,39.39 2.9,39.39 3.3,39.79 5.12,39.79 5.39,40.07 U$17.4
  Top 0.406: R11.1 2.75,34.08 R43.2
PRECHARGE_COMP_F
  Top 0.254: R56.2 85.41,10.16 C32.1 Q7.1
PRECHARGE_COMPLETE
  Top 0.406: LIGHTING.5 90.83,14.41 R55.1
PRECHARGE_COMPLETE_3_3  (via drill 0.35)
  Top 0.254: R74.1 80.81,8.51 Q7.3 76.2,16.05 76.2,23.5 68.58,31.11 v68.58,40.01 | v67.31,41.27 67.94,41.91 67.94,52.07 63.19,56.82 v62.87,56.82 | v62.87,58.04 v62.87,60.96 | v61.59,62.23 61.59,62.87 60.96,63.5 59.69,63.5 58.93,62.74 56.39,62.74 56.13,62.99 U1.42
  Bottom 0.254: v68.58,40.01 v67.31,41.27 | v62.87,56.82 v62.87,58.04 | v62.87,60.96 v61.59,62.23
PWR
  Top 0.813: POWER.1 67.58,86.63 67.94,87 70.23,87 71.12,86.11 75,86.11 FUSE.P$4 FUSE.P$1
RTD_EN  (via drill 0.35)
  Top 0.254: Q21.1 68.41,75.81 R32.2 65.58,72.99 65.58,67.55 63.9,65.86 58.98,65.86 v58.77,65.66 | U1.45 54.63,64.97 v55.71,66.04
  Bottom 0.254: v55.71,66.04 55.91,65.84 55.91,65.53 56.27,65.18 58.01,65.18 58.49,65.66 v58.77,65.66
RTDS_EN  (via drill 0.35)
  Top 0.254: v70.48,60.96 65.99,65.46 59.43,65.46 59.03,65.06 58.02,65.06 57.63,64.67 U1.39 | v70.48,59.05 70.48,55.73 Q4.1
  Bottom 0.254: v70.48,60.96 v70.48,59.05
SC_TH
  Top 0.254: R40.2 11.74,36.09 U$30.3 11.74,38.8 11.05,39.5 11.05,41.66 11.74,42.35 U$16.3
  Top 0.406: R39.1 9.73,34.08 R40.2
SCL_TC  (via drill 0.35)
  Top 0.254: v38.73,12.06 v42.55,8.26 43.6,9.31 R48.2 | U2.42 17.89,26.29 v17.64,26.04
  Bottom 0.254: v38.73,12.06 36.83,13.97 23.5,13.97 17.78,19.68 17.78,22.9 17.64,23.04 v17.64,26.04 | v42.55,8.26 42.55,7.28 U$12.3
  other vias: 44.42,5.4
SDA_TC  (via drill 0.35)
  Top 0.254: v47.15,5.53 U$12.4 | v17.03,23.5 17.61,23.5 v18.25,24.13 | v18.43,25.68 18.53,25.78 U2.43
  Bottom 0.254: v47.15,5.53 46.99,5.7 R47.2 45.06,11.24 45.06,11.26 44.7,11.62 44.2,11.62 44.01,11.43 38.1,11.43 35.97,13.56 23.33,13.56 17.37,19.52 17.37,22.73 17.03,23.07 v17.03,23.5 | v18.25,24.13 18.05,24.33 18.05,25.3 v18.43,25.68
  other vias: 46.99,9.31
SPI1_MISO
  Top 0.254: U1.16 54.63,52.73 53.98,52.07 47.62,52.07 41.27,45.72 41.27,37.44 29.11,25.27 U2.17
SPI1_MOSI
  Top 0.254: U2.16 29.2,24.79 41.68,37.27 41.68,45.55 47.79,51.66 54.14,51.66 55.04,52.56 55.04,54.53 55.12,54.61 U1.17
SPI1_NSS  (via drill 0.35)
  Top 0.254: U2.14 29.34,23.77 42.49,36.93 42.49,45.22 47.73,50.45 48.3,50.45 v48.9,51.05 | v50.52,53.08 50.72,52.88 52.63,52.88 53.62,53.87 U1.14
  Bottom 0.254: v48.9,51.05 49.92,52.07 50.03,52.07 50.52,52.55 v50.52,53.08
SPI1_SCK  (via drill 0.35)
  Top 0.254: U2.15 29.27,24.28 42.09,37.1 42.09,45.38 47.76,51.06 v48.05,51.06 | v49.78,52.68 49.98,52.48 53.75,52.48 54.13,52.86 U1.15
  Bottom 0.254: v48.05,51.06 49.66,52.68 v49.78,52.68
STEERING_POS
  Top 0.406: R78.1 57.78,10.16 59.05,8.89 60.33,8.89 60.96,8.26 THROTTLE_TC.3
STEERING_POS_F
  Top 0.254: R80.2 59.09,23.24 59.69,23.24 60.01,22.93 U$15.4 U$15.3
STEERING_POS_F_3_3  (via drill 0.35)
  Top 0.254: R80.1 R81.2 59.91,27.73 57.39,30.24 51.2,30.24 47.4,34.04 47.4,48.12 49.7,50.42 49.98,50.42 v50.62,51.06 | U1.12 50.85,56.95 50.29,56.39 50.29,54.74 50.78,54.25 51.35,54.25 51.71,53.89 51.71,53.79 v51.91,53.59
  Bottom 0.254: v51.91,53.59 51.71,53.39 51.71,52.43 50.62,51.34 v50.62,51.06
SWCLK  (via drill 0.35)
  Top 0.254: v59.69,64.77 59.44,64.52 58.67,64.52 58.62,64.47 U1.37
  Bottom 0.254: JP1.4 60.33,65.41 v59.69,64.77
SWCLK_TC
  Top 0.254: U2.37 19.91,32.74 20.32,33.15 20.32,36.2 20.95,36.83 22.35,36.83 24.13,35.05 JP2.4
SWDIO  (via drill 0.35)
  Top 0.254: v60.5,64.72 61.08,64.14 62.23,64.14 62.87,63.5 62.87,62.23 62.08,61.44 U1.34
  Bottom 0.254: JP1.3 58.09,69.85 59.89,71.65 60.76,71.65 61.37,71.04 61.37,68.61 60.73,67.97 60.73,64.95 v60.5,64.72
SWDIO_TC
  Top 0.254: JP2.3 22.38,34.14 U2.34
THROTTLE_A
  Top 0.406: THROTTLE_TC.1 64.96,8.45 65.41,8.89 68.58,8.89 69.22,9.53 R49.1
THROTTLE_A_F  (via drill 0.35)
  Top 0.254: R69.2 70.52,21.97 71.5,21.97 72.07,21.4 U$22.4 U$22.3
  Top 0.406: U$12.6 47.98,8.26 52.7,8.26 v53.34,7.62 | v66.67,5.71 69.22,8.26 72.39,8.26 73.66,9.53 73.66,17.14 72.42,18.39 U$22.3
  Bottom 0.406: v53.34,7.62 56.52,4.45 65.41,4.45 v66.67,5.71
THROTTLE_A_F_3_3  (via drill 0.35)
  Top 0.254: R69.1 69.64,24.56 R73.2 63.98,31.05 51.53,31.05 48.28,34.31 48.28,47.85 50.03,49.61 50.84,49.61 v52.29,51.06 | v55.65,52.7 55.65,52.94 55.45,53.14 55.45,54.3 55.63,54.48 U1.18
  Bottom 0.254: v52.29,51.06 53.94,52.7 v55.65,52.7
THROTTLE_B
  Top 0.406: R51.1 63.5,9.4 62.96,8.86 THROTTLE_TC.2
THROTTLE_B_F
  Top 0.254: R46.2 64.81,21.97 65.66,21.97 66.36,21.27 U$23.4 U$23.3
THROTTLE_B_F_3_3  (via drill 0.35)
  Top 0.254: R46.1 63.92,24.56 R72.2 58.67,30.65 51.36,30.65 47.8,34.21 47.8,47.95 49.87,50.01 50.43,50.01 51.23,50.8 51.23,50.85 v51.44,51.06 | v56.05,53.44 56.05,54.4 56.13,54.48 U1.19
  Bottom 0.254: v51.44,51.06 53.72,53.34 55.95,53.34 v56.05,53.44
THROTTLE_OUT
  Top 0.406: U$18.3 U$18.4 56.2,5.4 57.15,6.35 56.96,6.54 THROTTLE_TC.5
TSAL_EN
  Top 0.406: Q10.1 90.64,22.9 91.19,22.35 92.15,22.35 LIGHTING.1
TSAL_HV-
  Top 0.406: Q8.3 85.89,22.69 87.04,21.55 87.96,21.55 88.27,21.24 88.27,19.74 89.59,18.41 LIGHTING.3
TSAL_LV-
  Top 0.406: Q13.3 89.11,21.84 89.66,21.84 91.09,20.41 LIGHTING.2

## Text on the board
tNames: BSPD | BMS | IMD | Safety Board | Andrew Smith | Illini Formula Electric | Tractive System | Apollo 2019 V1.1